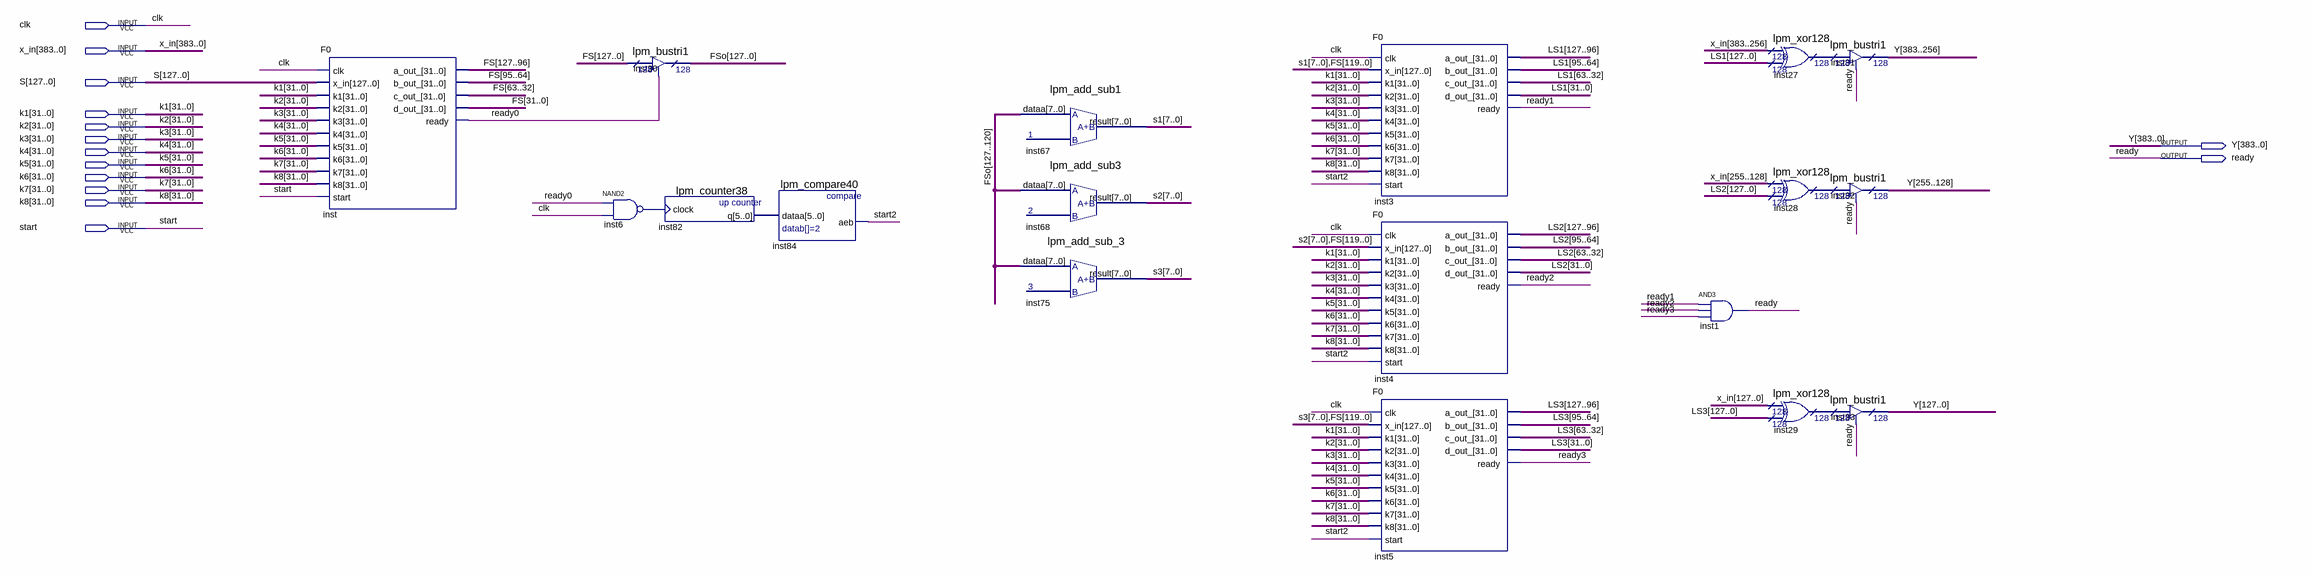
[diagram p0: schematic sheet]
// Quartus schematic cnt_f.bdf as structural Verilog: 18 symbols, 14 pins
module cnt_f (
  input  clk,
  input  [383:0] x_in,
  input  [127:0] S,
  input  [31:0] k1,
  input  [31:0] k2,
  input  [31:0] k3,
  input  [31:0] k4,
  input  [31:0] k5,
  input  [31:0] k6,
  input  [31:0] k7,
  input  [31:0] k8,
  input  start,
  output [383:0] Y,
  output ready
);

  wire inst6_out, ready0, ready1, ready2, ready3, start2;
  wire [5:0] inst82_q;
  wire [7:0] s1, s2, s3;
  wire [127:0] FS, FSo, inst27_result, inst28_result, inst29_result, LS1, LS2, LS3;

  F0 inst (
    .clk(clk), .x_in(S), .k1(k1), .k2(k2), .k3(k3), .k4(k4), .k5(k5), .k6(k6), .k7(k7), .k8(k8),
    .start(start), .a_out_(FS[127:96]), .b_out_(FS[95:64]), .c_out_(FS[63:32]), .d_out_(FS[31:0]),
    .ready(ready0));
  nand inst6 (inst6_out, ready0, clk);
  lpm_bustri1 inst30 (.enabledt(ready0), .data(FS), .tridata(FSo));
  lpm_counter38 inst82 (.clock(inst6_out), .q(inst82_q));
  lpm_compare40 inst84 (.dataa(inst82_q), .aeb(start2));
  lpm_add_sub1 inst67 (.dataa(FSo[127:120]), .result(s1));
  lpm_add_sub3 inst68 (.dataa(FSo[127:120]), .result(s2));
  lpm_add_sub_3 inst75 (.dataa(FSo[127:120]), .result(s3));
  F0 inst3 (
    .clk(clk), .x_in({s1, FS[119:0]}), .k1(k1), .k2(k2), .k3(k3), .k4(k4), .k5(k5), .k6(k6), .k7(k7),
    .k8(k8), .start(start2), .a_out_(LS1[127:96]), .b_out_(LS1[95:64]), .c_out_(LS1[63:32]),
    .d_out_(LS1[31:0]), .ready(ready1));
  F0 inst4 (
    .clk(clk), .x_in({s2, FS[119:0]}), .k1(k1), .k2(k2), .k3(k3), .k4(k4), .k5(k5), .k6(k6), .k7(k7),
    .k8(k8), .start(start2), .a_out_(LS2[127:96]), .b_out_(LS2[95:64]), .c_out_(LS2[63:32]),
    .d_out_(LS2[31:0]), .ready(ready2));
  F0 inst5 (
    .clk(clk), .x_in({s3, FS[119:0]}), .k1(k1), .k2(k2), .k3(k3), .k4(k4), .k5(k5), .k6(k6), .k7(k7),
    .k8(k8), .start(start2), .a_out_(LS3[127:96]), .b_out_(LS3[95:64]), .c_out_(LS3[63:32]),
    .d_out_(LS3[31:0]), .ready(ready3));
  and inst1 (ready, ready1, ready2, ready3);
  lpm_xor128 inst27 (.data0x(x_in[383:256]), .data1x(LS1), .result(inst27_result));
  lpm_xor128 inst28 (.data0x(x_in[255:128]), .data1x(LS2), .result(inst28_result));
  lpm_xor128 inst29 (.data0x(x_in[127:0]), .data1x(LS3), .result(inst29_result));
  lpm_bustri1 inst31 (.enabledt(ready), .data(inst27_result), .tridata(Y[383:256]));
  lpm_bustri1 inst32 (.enabledt(ready), .data(inst28_result), .tridata(Y[255:128]));
  lpm_bustri1 inst33 (.enabledt(ready), .data(inst29_result), .tridata(Y[127:0]));
endmodule
